# Altium schematic sheet FPGA_NuHorizons_Spartan3_Dev_Board.SchDoc: Example for NuHorizons Spartan3 Board
size B; Organization: Altium Limited; Address1: L3, 12a Rodborough Rd; Address2: Frenchs Forest; Address3: NSW; Address4: Australia 2086; DocumentNumber: 1; Revision: 0; SheetNumber: 1; SheetTotal: 1
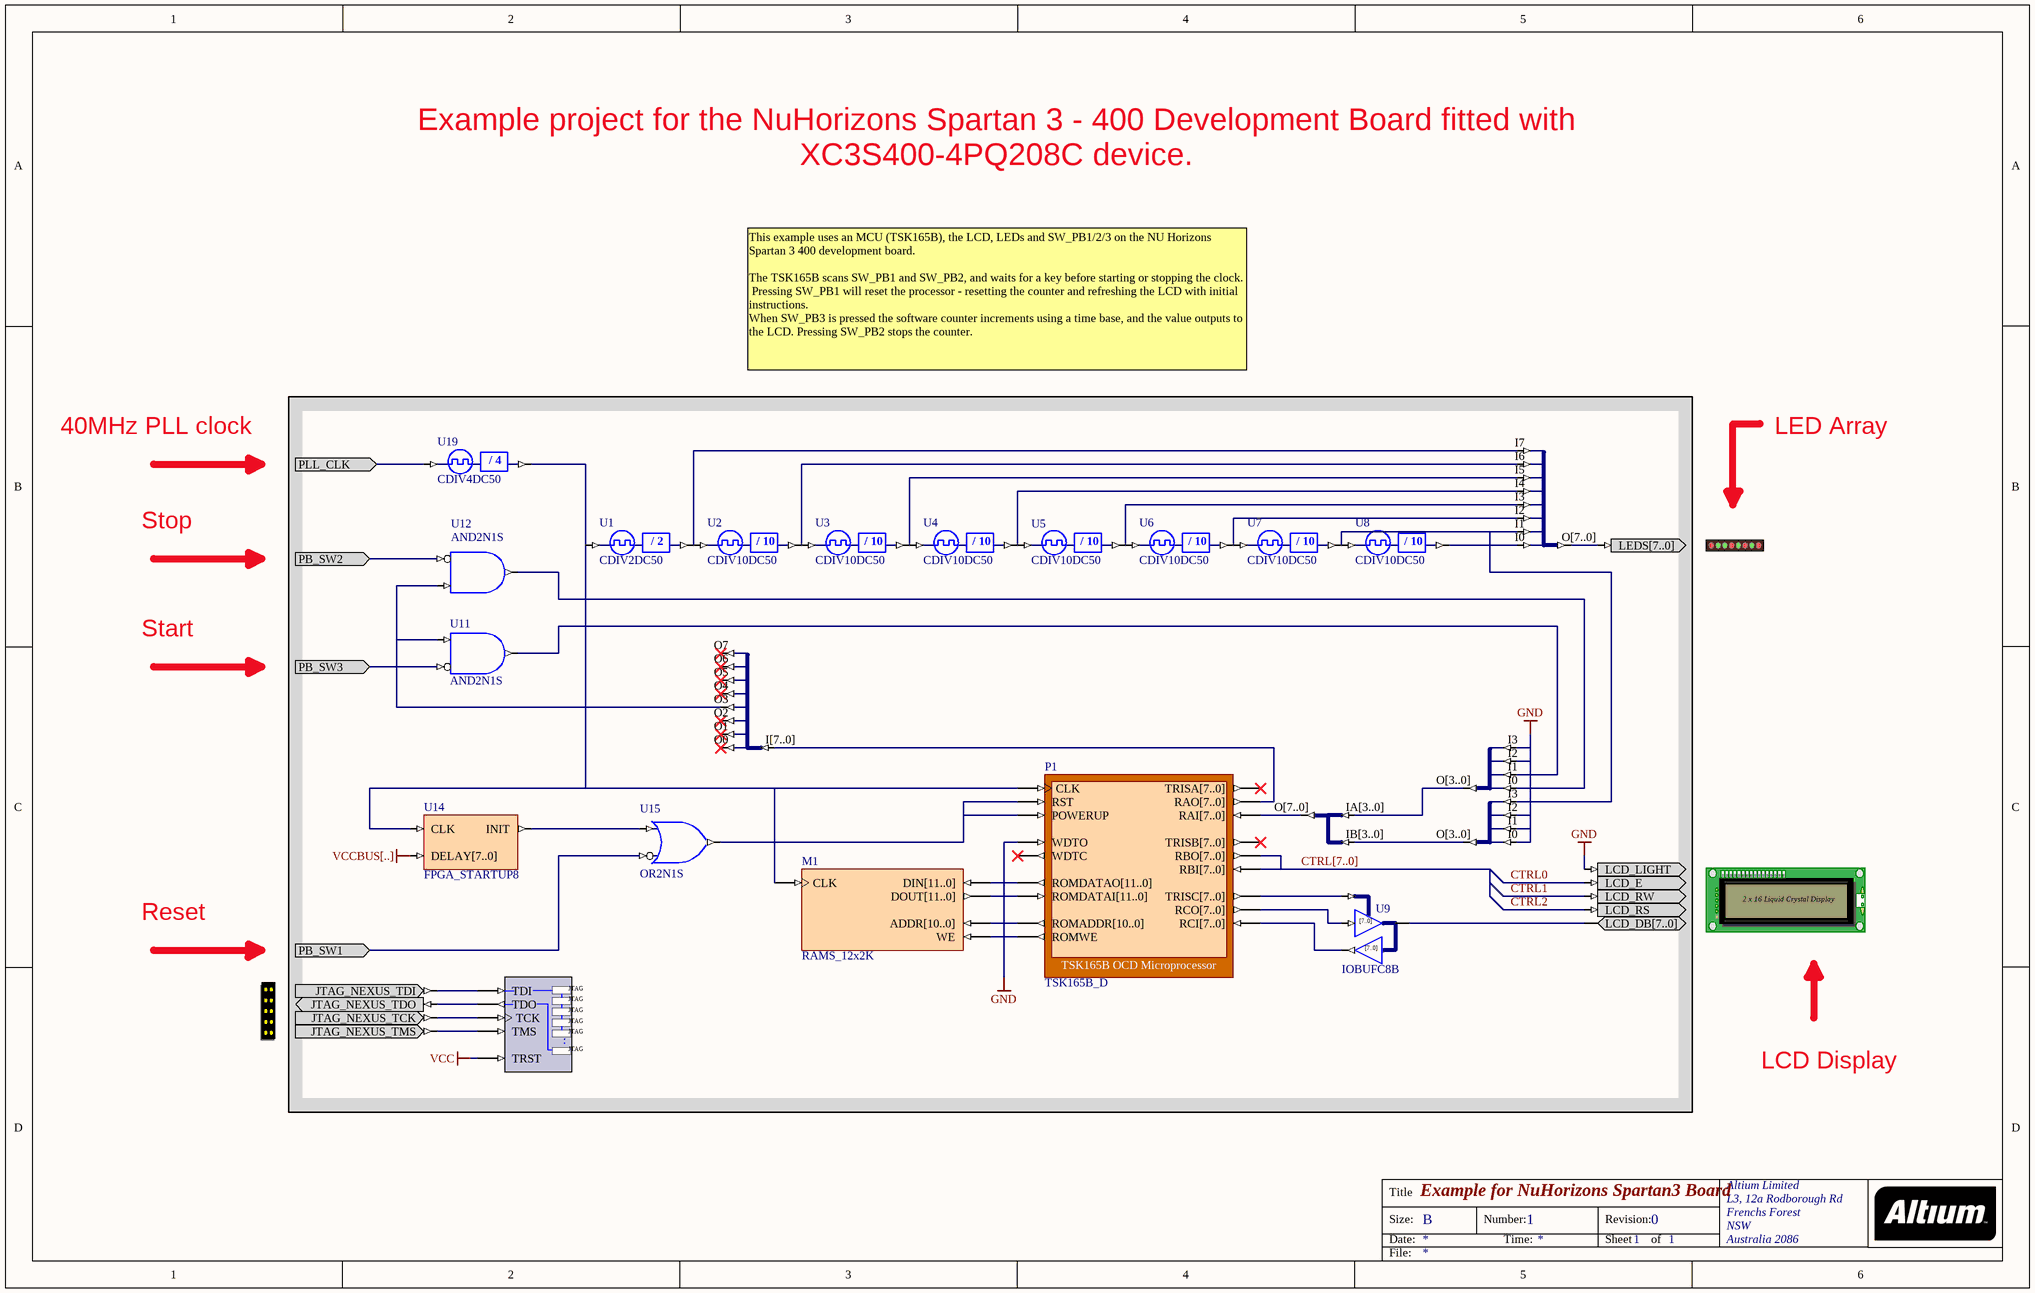
[diagram p0: FPGA_NuHorizons_Spartan3_Dev_Board.SchDoc]

## Parts
(Parts that share a designator on the sheet are numbered #1, #2 ... from top to bottom, then left to right.)
?#1  LED  (value not drawn)
?#2  LCD  (value not drawn)
?#3  NEXUS_JTAG_CONNECTOR  (value not drawn)
M1  RAMS_12x2K
NEXUS_JTAG_PORT  NEXUS_JTAG_PORT  (value not drawn)
P1  TSK165B_D
U1  CDIV2DC50
U2  CDIV10DC50
U3  CDIV10DC50
U4  CDIV10DC50
U5  CDIV10DC50
U6  CDIV10DC50
U7  CDIV10DC50
U8  CDIV10DC50
U9  IOBUFC8B
U10  J8S_8B  (value not drawn)
U11  AND2N1S
U12  AND2N1S
U13  J4B2_8B  (value not drawn)
U14  FPGA_STARTUP8
U15  OR2N1S
U16  J4S_4B  (value not drawn)
U17  J8B_8S  (value not drawn)
U18  J4S_4B  (value not drawn)
U19  CDIV4DC50

## Ports
PB_SW1 (in), PB_SW2 (in), PB_SW3 (in), PLL_CLK (in)

## Nets
GND: ?#2.LCD_LIGHT P1.WDTO U16.I0 U16.I1 U16.I2 U18.I2 U18.I3
VCC: NEXUS_JTAG_PORT.TRST
VCCBUS[..]: U14.DELAY[7..0]
CTRL0: ?#2.LCD_E
CTRL1: ?#2.LCD_RW
CTRL2: ?#2.LCD_RS
CTRL[7..0]: P1.RBI[7..0] P1.RBO[7..0]
PB_SW1: U15.I0 ; port PB_SW1
PB_SW2: U12.I0 ; port PB_SW2
PB_SW3: U11.I0 ; port PB_SW3
PLL_CLK: U19.CLKIN ; port PLL_CLK
Net?#1_LEDS[7..0]: ?#1.LEDS[7..0] U10.O[7..0]
Net?#2_LCD_DB[7..0]: ?#2.LCD_DB[7..0] U9.IO[7..0]
Net?#3_JTAG_NEXUS_TCK: ?#3.JTAG_NEXUS_TCK NEXUS_JTAG_PORT.TCK
Net?#3_JTAG_NEXUS_TDI: ?#3.JTAG_NEXUS_TDI NEXUS_JTAG_PORT.TDI
Net?#3_JTAG_NEXUS_TDO: ?#3.JTAG_NEXUS_TDO NEXUS_JTAG_PORT.TDO
Net?#3_JTAG_NEXUS_TMS: ?#3.JTAG_NEXUS_TMS NEXUS_JTAG_PORT.TMS
NetM1_ADDR[10..0]: M1.ADDR[10..0] P1.ROMADDR[10..0]
NetM1_CLK: M1.CLK P1.CLK U1.CLKIN U14.CLK U19.CLKDV
NetM1_DIN[11..0]: M1.DIN[11..0] P1.ROMDATAO[11..0]
NetM1_DOUT[11..0]: M1.DOUT[11..0] P1.ROMDATAI[11..0]
NetM1_WE: M1.WE P1.ROMWE
NetP1_POWERUP: P1.POWERUP P1.RST U15.O
NetP1_RAI[7..0]: P1.RAI[7..0] U13.O[7..0]
NetP1_RAO[7..0]: P1.RAO[7..0] U17.I[7..0]
NetP1_RCI[7..0]: P1.RCI[7..0] U9.O[7..0]
NetP1_RCO[7..0]: P1.RCO[7..0] U9.I[7..0]
NetP1_TRISC[7..0]: P1.TRISC[7..0] U9.T[7..0]
NetU1_CLKDV: U1.CLKDV U2.CLKIN U10.I7
NetU2_CLKDV: U2.CLKDV U3.CLKIN U10.I6
NetU3_CLKDV: U3.CLKDV U4.CLKIN U10.I5
NetU4_CLKDV: U4.CLKDV U5.CLKIN U10.I4
NetU5_CLKDV: U5.CLKDV U6.CLKIN U10.I3
NetU6_CLKDV: U6.CLKDV U7.CLKIN U10.I2
NetU7_CLKDV: U7.CLKDV U8.CLKIN U10.I1 U16.I3
NetU8_CLKDV: U8.CLKDV U10.I0
NetU11_I1: U11.I1 U12.I1 U17.O3
NetU11_O: U11.O U18.I1
NetU12_O: U12.O U18.I0
NetU13_IA[3..0]: U13.IA[3..0] U18.O[3..0]
NetU13_IB[3..0]: U13.IB[3..0] U16.O[3..0]
NetU14_INIT: U14.INIT U15.I1

Not connected (* = marked no-connect by the designer): P1 TRISA[7..0]* TRISB[7..0]* WDTC*; U17 O0* O1* O2* O4* O5* O6* O7*

## Buses and harness runs
bus CTRL[7..0]

## Notes on the sheet
- Example project for the NuHorizons Spartan 3 - 400 Development Board fitted with XC3S400-4PQ208C device.
- This example uses an MCU (TSK165B), the LCD, LEDs and SW_PB1/2/3 on the NU Horizons Spartan 3 400 development board.
  The TSK165B scans SW_PB1 and SW_PB2, and waits for a key before starting or stopping the clock.
  Pressing SW_PB1 will reset the processor - resetting the counter and refreshing the LCD with initial instructions.
  When SW_PB3 is pressed the software counter increments using a time base, and the value outputs to the LCD. Pressing SW_PB2 stops the counter.
- 40MHz PLL clock
- LED Array
- Stop
- Start
- Reset
- LCD Display
- Title
- Size:
- Date:
- B
- Number:
- Time:
- Revision:
- Sheet
- of
- File:
- (in symbol CDIV2DC50) / 2
- (in symbol CDIV4DC50) / 4
- (in symbol CDIV10DC50) / 10
- (in symbol IOBUFC8B) [7..0]
- (in symbol LCD) 2 x 16 Liquid Crystal Display
- (in symbol NEXUS_JTAG_PORT) .

## Library data of the parts
?#1 = LED: 8-Way LEDS; PortComponent: True; Published: 19-Nov-2003; Publisher: Altium Limited
?#2 = LCD: Liquid Crystal Display; PortComponent: True; Published: 19-Nov-2003; Publisher: Altium Limited
?#3 = NEXUS_JTAG_CONNECTOR: JTAG Port; PortComponent: True; Published: 19-Nov-2003; Publisher: Altium Limited
M1 = RAMS_12x2K: Single Port RAM; Memory_Depth: 2048; Memory_Type: RAM_SinglePortBlock; Memory_Width: 12; Memory_ClockEdge: Rising; Nexus_Core: Memory_Program; Memory_EnablePin: False; Published: 11/10/2004; Publisher: Altium Hobart Technology Center; Memory_ByteWrites: False
NEXUS_JTAG_PORT = NEXUS_JTAG_PORT: Soft Nexus-Chain Connector; NEXUS_JTAG_CONNECTOR: True; FunctionalClass: JTAG; Published: 29-Jan-2004; Publisher: Altium Limited; LastRevisionNo: 1.00.00; HelpURL: CR0118 FPGA Generic Library Guide.pdf#page=399
P1 = TSK165B_D: TSK165B OCD Microprocessor; NEXUS_CORE: Processor_OCDS; NEXUS_JTAG_DEVICE: True; NEXUS_JTAG_ORDER: 0; ChildModel1: TSK165B_D_RAM128x8; ChildCore1: M1; Published: 18/12/2003; Publisher: Altium Hobart Technology Centre; Core Revision: 1.00.00
U1 = CDIV2DC50: Clock Divider by 2 with 50% Duty Cycle Output; XilinxEquivalent: CLK_DIV2; DivisorRate: 2; DutyCycle: 50; ArchiveName: GENERIC; VHDLIB_SIM: GENERIC_LIB; Published: 29-Jan-2004; Publisher: Altium Limited; LastRevisionNo: 1.00.00; HelpURL: CR0118 FPGA Generic Library Guide.pdf#page=142; FunctionalClass: Clock Divider
U2-U8 = CDIV10DC50: Clock Divider by 10 with 50% Duty Cycle Output; XilinxEquivalent: CLK_DIV10; DivisorRate: 10; DutyCycle: 50; ArchiveName: GENERIC; VHDLIB_SIM: GENERIC_LIB; Published: 29-Jan-2004; Publisher: Altium Limited; LastRevisionNo: 1.00.00; HelpURL: CR0118 FPGA Generic Library Guide.pdf#page=142; FunctionalClass: Clock Divider
U9 = IOBUFC8B: 8-Bit Input/Output Buffer With Separated Control, Bus Version; ArchiveName: GENERIC; SubClass: IOBUFC; Enable: Low; Control: Separate Control T; PortSize: 8; VHDLIB_SIM: GENERIC_LIB; Published: 29-Jan-2004; Publisher: Altium Limited; LastRevisionNo: 1.00.00; HelpURL: CR0118 FPGA Generic Library Guide.pdf#page=294; FunctionalClass: Buffer; PortStyle: Bus Version
U10 = J8S_8B: 8 Single pin inputs to single 8-Bit output bus; ArchiveName: GENERIC; FunctionalClass: Bus Joiner; PortSize: 8; VHDLIB_SIM: GENERIC_LIB; Published: 29-Jan-2004; Publisher: Altium Limited; LastRevisionNo: 1.00.00; HelpURL: CR0118 FPGA Generic Library Guide.pdf#page=305
U11 U12 = AND2N1S: 2-Input AND Gate with Active Low A Input, Single Pin Version; XilinxEquivalent: AND2B1; FunctionalClass: Logic Primitive; PortSize: 2; ArchiveName: GENERIC; VHDLIB_SIM: GENERIC_LIB; Published: 29-Jan-2004; Publisher: Altium Limited; LastRevisionNo: 1.00.00; HelpURL: CR0118 FPGA Generic Library Guide.pdf#page=113; SubClass: AND; PortStyle: Single Pin Version
U13 = J4B2_8B: 2 x 4-Bit input bus to 1 x 8-bit output bus; ArchiveName: GENERIC; FunctionalClass: Bus Joiner; PortSize: 4; VHDLIB_SIM: GENERIC_LIB; Published: 29-Jan-2004; Publisher: Altium Limited; LastRevisionNo: 1.00.00; HelpURL: CR0118 FPGA Generic Library Guide.pdf#page=301
U14 = FPGA_STARTUP8: FPGA Startup With 8 Bit Delay; Published: 21/01/2004; Publisher: Altium Hobart Technology Centre; Core Revision: 1.00.00
U15 = OR2N1S: 2-Input OR Gate with Active Low A Input, Single Pin Version; ArchiveName: GENERIC; XilinxEquivalent: OR2B1; FunctionalClass: Logic Primitive; PortSize: 2; VHDLIB_SIM: GENERIC_LIB; Published: 29-Jan-2004; Publisher: Altium Limited; LastRevisionNo: 1.00.00; HelpURL: CR0118 FPGA Generic Library Guide.pdf#page=404; SubClass: OR; PortStyle: Single Pin Version
U16 = J4S_4B: 4 Single pin inputs to single 4-Bit output bus; ArchiveName: GENERIC; FunctionalClass: Bus Joiner; PortSize: 4; VHDLIB_SIM: GENERIC_LIB; Published: 29-Jan-2004; Publisher: Altium Limited; LastRevisionNo: 1.00.00; HelpURL: CR0118 FPGA Generic Library Guide.pdf#page=305
U17 = J8B_8S: 8-Bit input bus to 8 single pin outputs; FunctionalClass: Bus Joiner; PortSize: 8; ArchiveName: GENERIC; VHDLIB_SIM: GENERIC_LIB; Published: 29-Jan-2004; Publisher: Altium Limited; LastRevisionNo: 1.00.00; HelpURL: CR0118 FPGA Generic Library Guide.pdf#page=303
U18 = J4S_4B: 4 Single pin inputs to single 4-Bit output bus; FunctionalClass: Bus Joiner; PortSize: 4; ArchiveName: GENERIC; VHDLIB_SIM: GENERIC_LIB; Published: 29-Jan-2004; Publisher: Altium Limited; LastRevisionNo: 1.00.00; HelpURL: CR0118 FPGA Generic Library Guide.pdf#page=305
U19 = CDIV4DC50: Clock Divider by 4 with 50% Duty Cycle Output; XilinxEquivalent: CLK_DIV4; DivisorRate: 4; DutyCycle: 50; ArchiveName: GENERIC; VHDLIB_SIM: GENERIC_LIB; Published: 29-Jan-2004; Publisher: Altium Limited; LastRevisionNo: 1.00.00; HelpURL: CR0118 FPGA Generic Library Guide.pdf#page=142; FunctionalClass: Clock Divider